# Altium schematic sheet Sheet1.SchDoc
size A4
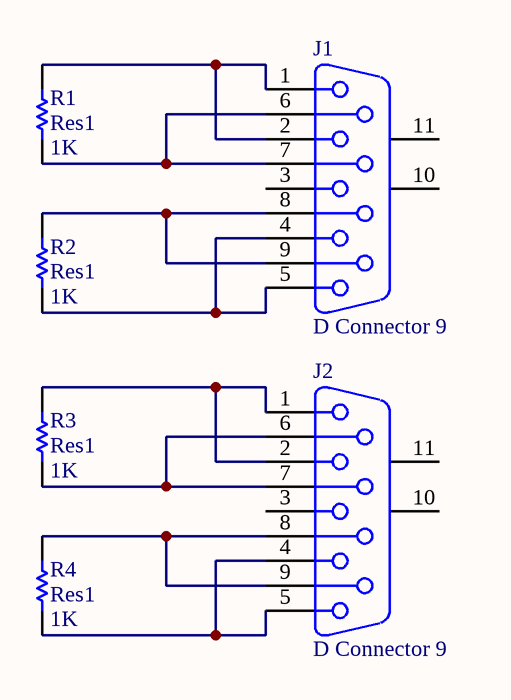
[diagram p0: Sheet1.SchDoc]

## Parts
J1  D Connector 9  [DSUB1.385-2H9]
J2  D Connector 9  [DSUB1.385-2H9]
R1  Res1  value 1K  [AXIAL-0.3]
R2  Res1  value 1K  [AXIAL-0.3]
R3  Res1  value 1K  [AXIAL-0.3]
R4  Res1  value 1K  [AXIAL-0.3]

## Nets
NetJ1_1: J1.1 J1.2 R1.2
NetJ1_4: J1.4 J1.5 R2.1
NetJ1_6: J1.6 J1.7 R1.1
NetJ1_8: J1.8 J1.9 R2.2
NetJ2_1: J2.1 J2.2 R3.2
NetJ2_4: J2.4 J2.5 R4.1
NetJ2_6: J2.6 J2.7 R3.1
NetJ2_8: J2.8 J2.9 R4.2

Not connected (* = marked no-connect by the designer): J1 3 10(MH1) 11(MH2); J2 3 10(MH1) 11(MH2)

## Library data of the parts
J1 J2 = D Connector 9: Receptacle Assembly, 9 Position, Right Angle; PackageDocument: O; Positions: 9; Published: 15-Jun-2001; LatestRevisionDate: 17-Jul-2002; LatestRevisionNote: Re-released for DXP Platform.; DatasheetDocument: 1-Sep-1999; PackageReference: 788750; Publisher: Altium Limited; Orientation: Right Angle; Gender: Receptacle
R1-R4 = Res1: Resistor; Published: 8-Jun-2000; LatestRevisionDate: 17-Jul-2002; LatestRevisionNote: Re-released for DXP Platform.; PackageReference: AXIAL-0.3; Publisher: Altium Limited; PackageDescription: Axial Device, Thru-Hole; 2 Leads; 0.3 in Pin Spacing